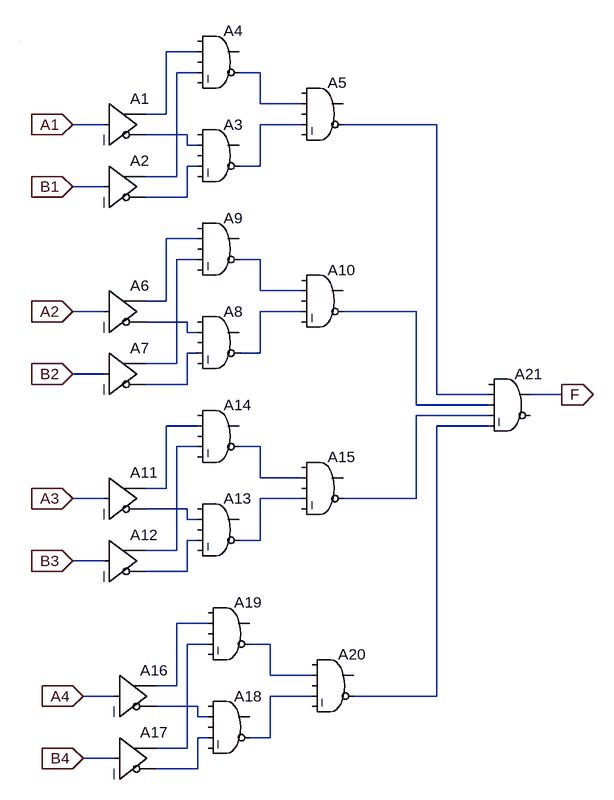
[diagram p0: schematic comparator.asc]
comparator.asc, the LTspice schematic file:
Version 4
SHEET 1 900 1176
WIRE 272 16 224 16
WIRE 272 48 240 48
WIRE 368 48 336 48
WIRE 368 96 368 48
WIRE 432 96 368 96
WIRE 224 112 224 16
WIRE 224 112 192 112
WIRE 128 128 80 128
WIRE 432 128 368 128
WIRE 640 128 496 128
WIRE 256 144 192 144
WIRE 256 160 256 144
WIRE 272 160 256 160
WIRE 272 192 256 192
WIRE 368 192 368 128
WIRE 368 192 336 192
WIRE 240 208 240 48
WIRE 240 208 192 208
WIRE 128 224 80 224
WIRE 256 240 256 192
WIRE 256 240 192 240
WIRE 272 304 224 304
WIRE 272 336 240 336
WIRE 368 336 336 336
WIRE 368 384 368 336
WIRE 432 384 368 384
WIRE 224 400 224 304
WIRE 224 400 192 400
WIRE 128 416 80 416
WIRE 432 416 368 416
WIRE 608 416 496 416
WIRE 256 432 192 432
WIRE 256 448 256 432
WIRE 272 448 256 448
WIRE 272 480 256 480
WIRE 368 480 368 416
WIRE 368 480 336 480
WIRE 240 496 240 336
WIRE 240 496 192 496
WIRE 128 512 80 512
WIRE 256 528 256 480
WIRE 256 528 192 528
WIRE 640 544 640 128
WIRE 720 544 640 544
WIRE 832 544 784 544
WIRE 608 560 608 416
WIRE 720 560 608 560
WIRE 720 576 608 576
WIRE 272 592 224 592
WIRE 720 592 640 592
WIRE 272 624 240 624
WIRE 368 624 336 624
WIRE 368 672 368 624
WIRE 432 672 368 672
WIRE 224 688 224 592
WIRE 224 688 192 688
WIRE 128 704 80 704
WIRE 432 704 368 704
WIRE 608 704 608 576
WIRE 608 704 496 704
WIRE 256 720 192 720
WIRE 256 736 256 720
WIRE 272 736 256 736
WIRE 272 768 256 768
WIRE 368 768 368 704
WIRE 368 768 336 768
WIRE 240 784 240 624
WIRE 240 784 192 784
WIRE 128 800 80 800
WIRE 256 816 256 768
WIRE 256 816 192 816
WIRE 288 896 240 896
WIRE 288 928 256 928
WIRE 384 928 352 928
WIRE 384 976 384 928
WIRE 448 976 384 976
WIRE 240 992 240 896
WIRE 240 992 208 992
WIRE 144 1008 96 1008
WIRE 448 1008 384 1008
WIRE 640 1008 640 592
WIRE 640 1008 512 1008
WIRE 272 1024 208 1024
WIRE 272 1040 272 1024
WIRE 288 1040 272 1040
WIRE 288 1072 272 1072
WIRE 384 1072 384 1008
WIRE 384 1072 352 1072
WIRE 256 1088 256 928
WIRE 256 1088 208 1088
WIRE 144 1104 96 1104
WIRE 272 1120 272 1072
WIRE 272 1120 208 1120
WIRE 0 0 0 0
FLAG 80 128 A1
IOPIN 80 128 In
FLAG 80 224 B1
IOPIN 80 224 In
FLAG 80 416 A2
IOPIN 80 416 In
FLAG 80 512 B2
IOPIN 80 512 In
FLAG 80 704 A3
IOPIN 80 704 In
FLAG 80 800 B3
IOPIN 80 800 In
FLAG 96 1008 A4
IOPIN 96 1008 In
FLAG 96 1104 B4
IOPIN 96 1104 In
FLAG 832 544 F
IOPIN 832 544 Out
SYMBOL Digital\\buf 128 64 R0
SYMATTR InstName A1
SYMBOL Digital\\buf 128 160 R0
SYMATTR InstName A2
SYMBOL Digital\\and 304 112 R0
SYMATTR InstName A3
SYMBOL Digital\\and 304 -32 R0
SYMATTR InstName A4
SYMBOL Digital\\and 464 48 R0
SYMATTR InstName A5
SYMBOL Digital\\buf 128 352 R0
SYMATTR InstName A6
SYMBOL Digital\\buf 128 448 R0
SYMATTR InstName A7
SYMBOL Digital\\and 304 400 R0
SYMATTR InstName A8
SYMBOL Digital\\and 304 256 R0
SYMATTR InstName A9
SYMBOL Digital\\and 464 336 R0
SYMATTR InstName A10
SYMBOL Digital\\buf 128 640 R0
SYMATTR InstName A11
SYMBOL Digital\\buf 128 736 R0
SYMATTR InstName A12
SYMBOL Digital\\and 304 688 R0
SYMATTR InstName A13
SYMBOL Digital\\and 304 544 R0
SYMATTR InstName A14
SYMBOL Digital\\and 464 624 R0
SYMATTR InstName A15
SYMBOL Digital\\buf 144 944 R0
SYMATTR InstName A16
SYMBOL Digital\\buf 144 1040 R0
SYMATTR InstName A17
SYMBOL Digital\\and 320 992 R0
SYMATTR InstName A18
SYMBOL Digital\\and 320 848 R0
SYMATTR InstName A19
SYMBOL Digital\\and 480 928 R0
SYMATTR InstName A20
SYMBOL Digital\\and 752 496 R0
SYMATTR InstName A21

The netlist it stands for:
* comparator.asc
A1 A1 0 0 0 0 N006 N001 0 BUF
A2 B1 0 0 0 0 N007 N002 0 BUF
A3 0 N006 0 N007 0 N004 0 0 AND
A4 0 N001 0 N002 0 N003 0 0 AND
A5 0 N003 0 N004 0 N005 0 0 AND
A6 A2 0 0 0 0 N013 N008 0 BUF
A7 B2 0 0 0 0 N014 N009 0 BUF
A8 0 N013 0 N014 0 N011 0 0 AND
A9 0 N008 0 N009 0 N010 0 0 AND
A10 0 N010 0 N011 0 N012 0 0 AND
A11 A3 0 0 0 0 N021 N016 0 BUF
A12 B3 0 0 0 0 N022 N018 0 BUF
A13 0 N021 0 N022 0 N020 0 0 AND
A14 0 N016 0 N018 0 N019 0 0 AND
A15 0 N019 0 N020 0 N015 0 0 AND
A16 A4 0 0 0 0 N027 N023 0 BUF
A17 B4 0 0 0 0 N028 N024 0 BUF
A18 0 N027 0 N028 0 N026 0 0 AND
A19 0 N023 0 N024 0 N025 0 0 AND
A20 0 N025 0 N026 0 N017 0 0 AND
A21 0 N005 N012 N015 N017 0 F 0 AND
.backanno
.end